# EasyEDA Pro project ProPrj_PiezoBuds-final_2024-09-30.epro

# Schematic Schematic1
Create Date: 2024-03-19; Page Name: P1; Project Name: PiezoBuds-final; Schematic Name: Schematic1; Update Date: 2024-03-19; Company: 嘉立创EDA; Page Size: A4; Version: V1.0
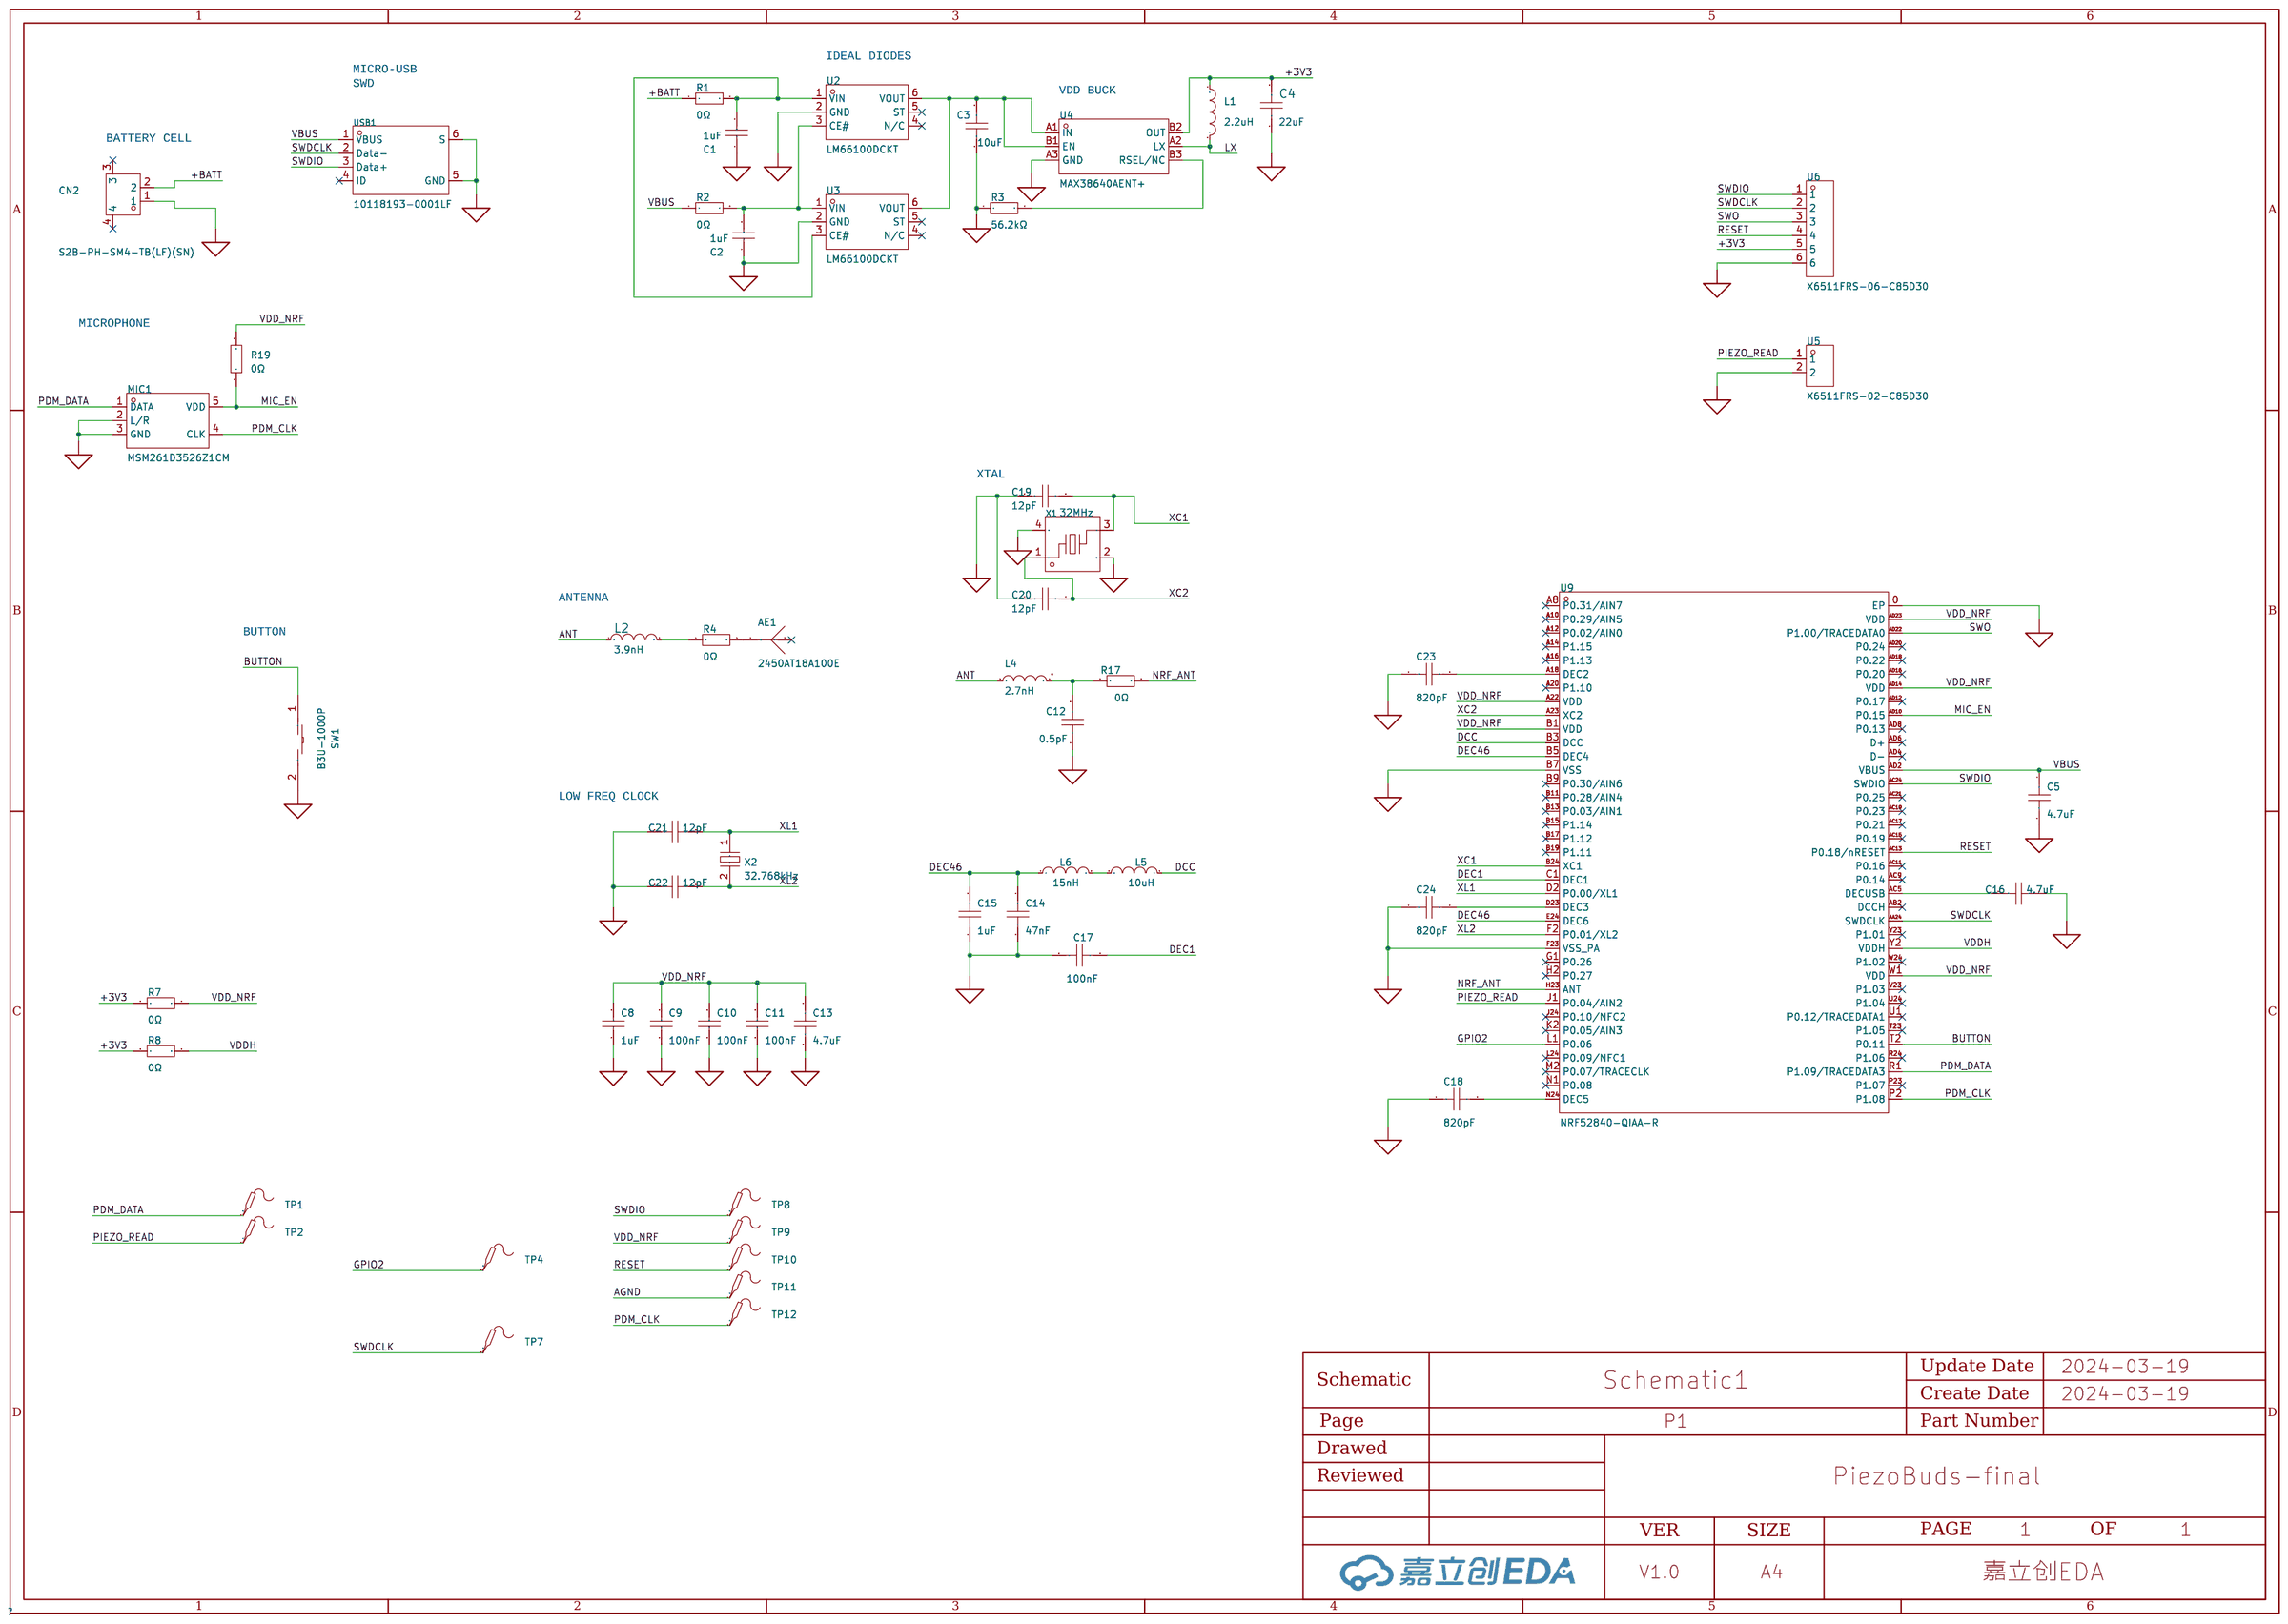
[diagram p0: schematic sheet]

## Parts
AE1  2450AT18A100E  [ANT-SMD_L3.2-W1.6]
C1  1uF  [C0402]
C2  1uF  [C0402]
C3  10uF  [C0402]
C4  22uF  [C0402]
C5  4.7uF  [C0402]
C8  1uF  [C0402]
C9  100nF  [C0201]
C10  100nF  [C0201]
C11  100nF  [C0201]
C12  0.5pF  [C0201]
C13  4.7uF  [C0402]
C14  47nF  [C0201]
C15  1uF  [C0402]
C16  4.7uF  [C0402]
C17  100nF  [C0201]
C18  820pF  [C0201]
C19  12pF  [C0201]
C20  12pF  [C0201]
C21  12pF  [C0201]
C22  12pF  [C0201]
C23  820pF  [C0201]
C24  820pF  [C0201]
CN2  S2B-PH-SM4-TB(LF)(SN)  [CONN-SMD_P2.00_S2B-PH-SM4-TB-LF-SN]
L1  2.2uH  [L0603]
L2  3.9nH  [IND-SMD_L1.0-W0.5-2]
L4  2.7nH  [L0201-RD]
L5  10uH  [L0603]
L6  15nH  [L0201]
MIC1  MSM261D3526Z1CM  [OCLGA-6_L3.5-W2.7-TL-MSM261D3526Z1CM]
R1  0Ω  [R0201]
R2  0Ω  [R0201]
R3  56.2kΩ  [R0201]
R4  0Ω  [R0201]
R7  0Ω  [R0402]
R8  0Ω  [R0402]
R17  0Ω  [R0201]
R19  0Ω  [R0201]
SW1  B3U-1000P  [KEY-SMD_B3U-1000PM]
TP1  -  [Test-Point-0.5mm]
TP2  -  [Test-Point-0.5mm]
TP4  -  [Test-Point-0.5mm]
TP7  -  [Test-Point-0.5mm]
TP8  -  [Test-Point-0.5mm]
TP9  -  [Test-Point-0.5mm]
TP10  -  [Test-Point-0.5mm]
TP11  -  [Test-Point-0.5mm]
TP12  -  [Test-Point-0.5mm]
U2  LM66100DCKT  [SC-70-6_L2.0-W1.3-P0.65-LS2.1-BL]
U3  LM66100DCKT  [SC-70-6_L2.0-W1.3-P0.65-LS2.1-BL]
U4  MAX38640AENT+  [WLP-6_L1.4-W0.9-R2-C3-P0.40-TL]
U5  X6511FRS-02-C85D30  [HDR-SMD_2P-P2.54-H-F-L11.5]
U6  X6511FRS-06-C85D30  [HDR-SMD_6P-P2.54-H-F-L11.5]
U9  NRF52840-QIAA-R  [AQFN-73_L7.0-W7.0-P0.50-BL-EP4.8]
USB1  10118193-0001LF  [MICRO-USB-SMD_10118193-0001LF]
X1  32MHz  [CRYSTAL-SMD_4P-L2.0-W1.6-BL]
X2  32.768kHz  [CRYSTAL-SMD_L3.2-W1.5-1]

## Library data of the parts
AE1 = 2450AT18A100E: 天线类型:迷你2.45 GHz天线;中心频点:2.4GHz;带宽:-;峰值增益:0.5dBi;驻波比:-;极化方式:-;阻抗:50Ω;功率容量:2W;; Supplier Part: C89334; Manufacturer: JOHANSON(约翰逊); Supplier Footprint: 3.2mmLx1.6mmWx1.3mmH; JLCPCB Part Class: 扩展库; Datasheet: https://atta.szlcsc.com/upload/public/pdf/source/20180301/C89334_15198946260391384223.pdf; Supplier: LCSC; Antenna Type: 迷你2.45 GHz天线; Central Frequency: 2.4GHz; Peak Gain: 0.5dBi; Impedance: 50Ω; Power capacity: 2W; Operating Temperature: -40℃~+125℃
C1 C2 C8 = CL05A105KQ5NNNC: 容值:1uF;精度:±10%;额定电压:6.3V;材质(温度系数):X5R;; LCSC Part Name: 1uF ±10% 6.3V; Supplier Part: C107372; Manufacturer: SAMSUNG(三星); Supplier Footprint: 0402; JLCPCB Part Class: 扩展库; Datasheet: https://atta.szlcsc.com/upload/public/pdf/source/20170413/1492062766541.pdf; Supplier: LCSC; Tolerance: ±10%; Voltage Rated: 6.3V; Temperature Coefficient: X5R
C3 = CL05A106MP5NUNC: 容值:10uF;精度:±20%;额定电压:10V;材质(温度系数):X5R;; LCSC Part Name: 10uF ±20% 10V; Supplier Part: C315248; Manufacturer: SAMSUNG(三星); Supplier Footprint: 0402; JLCPCB Part Class: 扩展库; Datasheet: https://atta.szlcsc.com/upload/public/pdf/source/20200102/C478861_C4302703595930F3C0E62DAD3349F1AA.pdf; Supplier: LCSC; Tolerance: ±20%; Voltage Rated: 10V; Temperature Coefficient: X5R
C4 = GRM155R60J226ME11D: 容值:22uF;精度:±20%;额定电压:6.3V;材质(温度系数):X5R;; LCSC Part Name: 22uF ±20% 6.3V; Supplier Part: C415703; Manufacturer: muRata(村田); Supplier Footprint: 0402; JLCPCB Part Class: 扩展库; Datasheet: https://atta.szlcsc.com/upload/public/pdf/source/20200305/C490387_23319AE8C154DEB24C505E6C82A8106A.pdf; Supplier: LCSC; Tolerance: ±20%; Voltage Rated: 6.3V; Temperature Coefficient: X5R
C5 = C1005X6S0G475M050BC: 容值:4.7uF;精度:±20%;额定电压:4V;材质(温度系数):X6S;; LCSC Part Name: 4.7uF ±20% 4V; Supplier Part: C2168059; Manufacturer: TDK; Supplier Footprint: 0402; JLCPCB Part Class: 扩展库; Datasheet: https://atta.szlcsc.com/upload/public/pdf/source/20210430/12912E3792F621391F28022904E5A4A4.pdf; Supplier: LCSC; Tolerance: ±20%; Voltage Rated: 4V; Temperature Coefficient: X6S
C9-C11 = GRM033C71C104KE14D: 容值:100nF;精度:±10%;额定电压:16V;材质(温度系数):X7S;; LCSC Part Name: 100nF ±10% 16V; Supplier Part: C85923; Manufacturer: muRata(村田); Supplier Footprint: 0201; JLCPCB Part Class: 扩展库; Datasheet: https://atta.szlcsc.com/upload/public/pdf/source/20180326/C85923_B6CADFAB9310CDDF0A43189D0F44CCF4.pdf; Supplier: LCSC; Tolerance: ±10%; Voltage Rated: 16V; Temperature Coefficient: X7S
C12 = 0201CG0R5B250NT: 容值:0.5pF;额定电压:25V;材质(温度系数):C0G;; LCSC Part Name: 0.5pF 25V ±0.1pF; Supplier Part: C285115; Manufacturer: FH(风华); Supplier Footprint: 0201; JLCPCB Part Class: Extended Part; Datasheet: https://atta.szlcsc.com/upload/public/pdf/source/20180917/C285115_430A46DCDD77E98C3CB63F008439EE94.pdf; Supplier: LCSC; Voltage Rated: 25V; Temperature Coefficient: C0G
C13 C16 = CL05A475KP5NRNC: 容值:4.7uF;精度:±10%;额定电压:10V;材质(温度系数):X5R;; LCSC Part Name: 4.7uF ±10% 10V; Supplier Part: C368809; Manufacturer: SAMSUNG(三星); Supplier Footprint: 0402; JLCPCB Part Class: Extended Part; Datasheet: https://atta.szlcsc.com/upload/public/pdf/source/20190214/C368809_F5BC89A17870A6A4D09EEE17ED063906.pdf; Supplier: LCSC; Tolerance: ±10%; Voltage Rated: 10V; Temperature Coefficient: X5R
C14 = CL03A473KQ3NNNC: 容值:47nF;精度:±10%;额定电压:6.3V;材质(温度系数):X5R;; LCSC Part Name: 47nF ±10% 6.3V; Supplier Part: C318551; Manufacturer: SAMSUNG(三星); Supplier Footprint: 0201; JLCPCB Part Class: Extended Part; Datasheet: https://atta.szlcsc.com/upload/public/pdf/source/20181113/C318551_E4E5F1A22752090EA3F567BE743DB571.pdf; Supplier: LCSC; Tolerance: ±10%; Voltage Rated: 6.3V; Temperature Coefficient: X5R
C15 = GRM155R70J105KA12D: 容值:1uF;精度:±10%;额定电压:6.3V;材质(温度系数):X7R;; LCSC Part Name: 1uF ±10% 6.3V; Supplier Part: C88945; Manufacturer: muRata(村田); Supplier Footprint: 0402; JLCPCB Part Class: 扩展库; Datasheet: https://atta.szlcsc.com/upload/public/pdf/source/20161125/1480068029517.pdf; Supplier: LCSC; Tolerance: ±10%; Voltage Rated: 6.3V; Temperature Coefficient: X7R
C17 = CL03A104KQ3NNNC: 容值:100nF;精度:±10%;额定电压:6.3V;材质(温度系数):X5R;; LCSC Part Name: 100nF ±10% 6.3V; Supplier Part: C160831; Manufacturer: SAMSUNG(三星); Supplier Footprint: 0201; JLCPCB Part Class: 扩展库; Datasheet: https://atta.szlcsc.com/upload/public/pdf/source/20171228/C160831_15144412250661213800.pdf; Supplier: LCSC; Tolerance: ±10%; Voltage Rated: 6.3V; Temperature Coefficient: X5R
C18 C23 C24 = GRM0335C1E821JA01D: 容值:820pF;精度:±5%;额定电压:25V;材质(温度系数):C0G;; LCSC Part Name: 820pF ±5% 25V; Supplier Part: C384953; Manufacturer: muRata(村田); Supplier Footprint: 0201; JLCPCB Part Class: 扩展库; Datasheet: https://atta.szlcsc.com/upload/public/pdf/source/20190819/C384953_90F8D2DF1F187266CD17B94714A2AC04.pdf; Supplier: LCSC; Tolerance: ±5%; Voltage Rated: 25V; Temperature Coefficient: C0G
C19-C22 = GRM0335C1E120GA01D: 容值:12pF;精度:±2%;额定电压:25V;材质(温度系数):C0G;; LCSC Part Name: 12pF ±2% 25V; Supplier Part: C426109; Manufacturer: muRata(村田); Supplier Footprint: 0201; JLCPCB Part Class: Extended Part; Datasheet: https://atta.szlcsc.com/upload/public/pdf/source/20190904/C426109_89A0F94841657D9DD7212A5F70B4EFC9.pdf; Supplier: LCSC; Tolerance: ±2%; Voltage Rated: 25V; Temperature Coefficient: C0G
CN2 = S2B-PH-SM4-TB(LF)(SN): 插针结构:1x2P;间距:2mm;安装方式:卧贴;参考系列:PH;总PIN数:2P;排数:1;每排PIN数:2;行距:-;额定电流:2A;触头材质:铜合金;触头镀层:锡;工作温度范围:-25℃~+85℃;; Supplier Part: C295747; Manufacturer: JST; Supplier Footprint: SMD,P=2mm,卧贴; JLCPCB Part Class: 扩展库; Datasheet: https://atta.szlcsc.com/upload/public/pdf/source/20210203/C295747_344B2E64535E381E727D98C302AB61C7.pdf; Supplier: LCSC; Pins Structure: 1x2P; Pitch: 2mm; Mounting Style: 卧贴; Reference Series: PH; Number of Pins: 2P; Number of Rows: 1; Number of PINs Per Row: 2; Current Rating (Max): 2A; Contact Material: 铜合金; Contact Plating: 锡; Operating Temperature Range: -25℃~+85℃
L1 = SLM16082R2MIT: 类型:-;电感值:2.2uH;精度:±20%;额定电流:250mA;饱和电流(Isat):-;; LCSC Part Name: 2.2uH ±20% 250mA 520mΩ; Supplier Part: C206337; Manufacturer: Sunltech(韩国顺磁); Supplier Footprint: 0603; JLCPCB Part Class: 扩展库; Datasheet: https://atta.szlcsc.com/upload/public/pdf/source/20180403/C206337_E548C6A727BE278C464F4936109BA35D.pdf; Supplier: LCSC; Tolerance: ±20%; Rated Current: 250mA; DC Resistance (DCR): 520mΩ
L2 = LQW15AN3N9C00D: 电感值:3.9nH;额定电流:-;饱和电流(Isat):-;直流电阻(DCR):70mΩ;; Supplier Part: C98063; Manufacturer: muRata(村田); Supplier Footprint: 0402; JLCPCB Part Class: 扩展库; Datasheet: https://atta.szlcsc.com/upload/public/pdf/source/20191016/C437364_463D6516B3BAE72B1DA0754F3D9B8308.pdf; Supplier: LCSC; DC Resistance (DCR): 70mΩ; Q @ Freq: 25@250MHz; Frequency - Self Resonant: 10GHz
L4 = LQP03TG2N7B02D: 电感值:2.7nH;精度:-;额定电流:450mA;饱和电流(Isat):-;直流电阻(DCR):250mΩ;; LCSC Part Name: 2.7nH ±0.1nH; Supplier Part: C86109; Manufacturer: muRata(村田); Supplier Footprint: 0201; JLCPCB Part Class: 扩展库; Datasheet: https://atta.szlcsc.com/upload/public/pdf/source/20180327/C86109_85E67C6134C24C7F74EB92E54F80A506.pdf; Supplier: LCSC; Rated Current: 450mA; DC Resistance (DCR): 250mΩ; Q @ Freq: 13@500MHz; Frequency - Self Resonant: 13.1GHz
L5 = MLZ1608N100LT000: 电感值:10uH;精度:±20%;额定电流:300mA;饱和电流(Isat):60mA;直流电阻(DCR):600mΩ;; LCSC Part Name: 10uH ±20% 60mA; Supplier Part: C194437; Manufacturer: TDK; Supplier Footprint: 0603; JLCPCB Part Class: 扩展库; Datasheet: https://atta.szlcsc.com/upload/public/pdf/source/20190107/C194437_EB92F128B114A0F5510FACF64F923EBD.pdf; Supplier: LCSC; Tolerance: ±20%; Rated Current: 300mA; Saturation Current (Isat): 60mA; DC Resistance (DCR): 600mΩ
L6 = LQP03TN15NJ02D: 直流电阻(DCR):700mΩ;精度:±5%;电感值:15nH;额定电流:3.8A;饱和电流(Isat):-;; LCSC Part Name: 15nH ±5%; Supplier Part: C206455; Manufacturer: muRata(村田); Supplier Footprint: 0201; JLCPCB Part Class: Extended Part; Datasheet: https://atta.szlcsc.com/upload/public/pdf/source/20180612/C206455_9F5A8FF86B12D39600F2157860CD3357.pdf; Supplier: LCSC; DC Resistance (DCR): 700mΩ; Tolerance: ±5%; Rated Current: 3.8A; Q @ Freq: 12 500MHz; Frequency - Self Resonant: 2.6GHz
MIC1 = MSM261D3526Z1CM: 方向:全指向;灵敏度:-26dB；-25dB;信噪比:62dB；64dB;电流消耗:670uA；290uA;电源电压:1.8V;阻抗:-;; Supplier Part: C966937; Manufacturer: MEMS(敏芯微); Supplier Footprint: LGA-5(2.7x3.5); Datasheet: https://atta.szlcsc.com/upload/public/pdf/source/20210104/C966937_DDD8123A44DF487854FEE980E1D7EA5A.pdf; Supplier: LCSC; Direction: 全指向; Sensitivity: -26dB；-25dB; SNR(Signal to Noise Ratio): 62dB；64dB; Current Consumption: 670uA；290uA; Supply Voltage: 1.8V
R1 R2 R4 R17 R19 = RC0201JR-070RL: 温度系数:-;工作温度范围:-55℃~+155℃;电阻长:-;精度:±5%;电阻直径:-;电阻高:-;电阻宽:-;最大工作电压:25V;电阻类型:厚膜电阻;阻值:0Ω;功率:50mW;; LCSC Part Name: 0Ω ±5%; Supplier Part: C106228; Manufacturer: YAGEO(国巨); Supplier Footprint: 0201; JLCPCB Part Class: 扩展库; Datasheet: https://atta.szlcsc.com/upload/public/pdf/source/20170912/C106228_1505207468789963235.pdf; Supplier: LCSC; Operating Temperature Range: -55℃~+155℃; Tolerance: ±5%; Overload Voltage (Max): 25V; Type: 厚膜电阻; Power(Watts): 50mW
R3 = RC0201FR-0756K2L: 电阻类型:厚膜电阻;阻值:56.2kΩ;精度:±1%;功率:50mW;最大工作电压:25V;温度系数:±200ppm/℃;; LCSC Part Name: 厚膜电阻 56.2kΩ ±1% 50mW; Supplier Part: C327383; Manufacturer: YAGEO(国巨); Supplier Footprint: 0201; JLCPCB Part Class: Extended Part; Datasheet: https://atta.szlcsc.com/upload/public/pdf/source/20181031/C327383_E4A175C782E789857E6379955203C984.pdf; Supplier: LCSC; Type: 厚膜电阻; Tolerance: ±1%; Power(Watts): 50mW; Overload Voltage (Max): 25V; Temperature Coefficient: ±200ppm/℃; Operating Temperature Range: -55℃~+125℃
R7 R8 = RC0402FR-070RL: 电阻类型:厚膜电阻;阻值:0Ω;精度:-;功率:62.5mW;; LCSC Part Name: 0Ω 62.5mW; Supplier Part: C106231; Manufacturer: YAGEO(国巨); Supplier Footprint: 0402; JLCPCB Part Class: 扩展库; Datasheet: https://atta.szlcsc.com/upload/public/pdf/source/20170518/1495085712260.pdf; Supplier: LCSC; Type: 厚膜电阻; Power(Watts): 62.5mW; Overload Voltage (Max): 50V; Operating Temperature Range: -55℃~+155℃
SW1 = B3U-1000P: 触点电流:50mA;额定电压(DC):12V;电路结构:单刀单掷;安装方式:立贴;带灯:-;机械寿命:-;; LCSC Part Name: 3*2.5*1.6mm 立贴 轻触开关; Supplier Part: C231329; Manufacturer: OMRON(欧姆龙); Supplier Footprint: SMD,2.5x3mm; JLCPCB Part Class: 扩展库; Datasheet: https://atta.szlcsc.com/upload/public/pdf/source/20180629/C231329_070179C33643744C5978F4F02109B85D.pdf; Supplier: LCSC; Contact Current: 50mA; Voltage Rating (DC): 12V; Circuit: 单刀单掷; Mounting Style: 立贴; Actuator Style: 圆形按钮; Switch Length: 3mm; Switch Width: 2.5mm; Switch Height: 1.6mm
TP1 TP2 TP4 TP7-TP12 = Test-Point: Test Point 测试点
U2 U3 = LM66100DCKT_C2832141: Supplier Part: C2832141; Manufacturer: TI(德州仪器); Supplier Footprint: SC-70-6; JLCPCB Part Class: 扩展库; Datasheet: 2021-05-06/732163A/921a6e0c70be483eae5728de2d2d7fc9/lm66100.pdf; Supplier: LCSC
U4 = MAX38640AENT+: Supplier Part: C5328753; Manufacturer: ADI(亚德诺); Supplier Footprint: WLP-6; JLCPCB Part Class: Extended Part; Datasheet: https://atta.szlcsc.com/upload/public/pdf/source/20210226/C1544069_75AFA4CA0D4CEB88C64289422689D1E7.pdf; Supplier: LCSC
U5 = X6511FRS-02-C85D30: 插孔结构:1x2P;间距:2.54mm;安装类型:卧贴;排数:单排;总孔位数:2P;塑高:8.5mm;; LCSC Part Name: 间距:2.54mm 1x2P 卧贴; Supplier Part: C5142235; Manufacturer: XKB Connectivity(中国星坤); Supplier Footprint: SMD,P=2.54mm,卧贴; JLCPCB Part Class: 扩展库; Datasheet: https://atta.szlcsc.com/upload/public/pdf/source/20220822/AB9A82E80C220285963E5EFA3BFD32FF.pdf; Supplier: LCSC; Holes Structure: 1x2P; Pitch: 2.54mm; Mounting Type: 卧贴; Number of Rows: 单排; Number of Holes: 2P; Insulation Height: 8.5mm
U6 = X6511FRS-06-C85D30: 插孔结构:1x6P;间距:2.54mm;安装类型:卧贴;排数:单排;总孔位数:6P;塑高:8.5mm;; LCSC Part Name: 间距:2.54mm 1x6P 卧贴; Supplier Part: C5142239; Manufacturer: XKB Connectivity(中国星坤); Supplier Footprint: SMD,P=2.54mm,卧贴; JLCPCB Part Class: 扩展库; Datasheet: https://atta.szlcsc.com/upload/public/pdf/source/20220822/AB9A82E80C220285963E5EFA3BFD32FF.pdf; Supplier: LCSC; Holes Structure: 1x6P; Pitch: 2.54mm; Mounting Type: 卧贴; Number of Rows: 单排; Number of Holes: 6P; Insulation Height: 8.5mm
U9 = NRF52840-QIAA-R: LCSC Part Name: 蓝牙，IEEE 802.15.4-2006，2.4GHz收发器; Supplier Part: C190794; Manufacturer: NORDIC; Supplier Footprint: AQFN-73-EP(7x7); JLCPCB Part Class: 扩展库; Datasheet: https://atta.szlcsc.com/upload/public/pdf/source/20200927/C190794_1756B5489BD6AA72AA26FA1BF8B48337.pdf; Supplier: LCSC
USB1 = 10118193-0001LF: Supplier Part: C132562; Manufacturer: Amphenol; Supplier Footprint: SMD; JLCPCB Part Class: 扩展库; Supplier: LCSC
X1 = Q22FA1280002500: 晶振类型:贴片晶振;频率:32MHz;常温频差:±10ppm;外接负载电容:8pF;; LCSC Part Name: 32MHz ±10ppm 8pF; Supplier Part: C187794; Manufacturer: EPSON(爱普生); Manufacturer Part: Q22FA12800025; Supplier Footprint: SMD2016-4P; JLCPCB Part Class: Extended Part; Datasheet: https://atta.szlcsc.com/upload/public/pdf/source/20180822/C255901_8E0AFBA406FEDAEAC9B2913D0F1BB689.pdf; Supplier: LCSC; Crystal Type: 贴片晶振; Frequency Tolerance: ±10ppm; Load Capacitance: 8pF; Equivalent Series Resistance (ESR): 60Ω; Operating Temperature: -40℃~+85℃; Normal temperature Frequency Tolerance: ±10ppm; External load capacitor: 8pF
X2 = NX3215SA-32.768K-STD-MUA-9: 晶振类型:-;频率:32.768kHz;常温频差:±20ppm;外接负载电容:9pF;; LCSC Part Name: 32.768kHz ±20ppm 9pF; Supplier Part: C519280; Manufacturer: NDK; Supplier Footprint: SMD3215-2P; JLCPCB Part Class: Extended Part; Datasheet: https://atta.szlcsc.com/upload/public/pdf/source/20200427/C519280_14BACA32631F1F3A49A8251846C55372.pdf; Supplier: LCSC; Operating Temperature: -40℃~+85℃; Normal temperature Frequency Tolerance: ±20ppm; External load capacitor: 9pF; Equivalent Series Resistance (ESR): 70kΩ

## Nets
+3V3: C4.2 L1.1 R7.1 R8.1 U4.B2(OUT) U6.5
AGND: C1.1 C2.1 C3.1 C4.1 C5.2 C8.1 C9.2 C10.2 C11.2 C12.1 C13.1 C14.2 C15.1 C16.1 C17.2 C18.1 C19.1 C20.1 C21.1 C22.1 C23.1 C24.1 CN2.1 MIC1.2(L/R) MIC1.3(GND) R3.1 SW1.2 TP11.1 U2.2(GND) U3.2(GND) U4.A3(GND) U5.2 U6.6 U9.0(EP) U9.B7(VSS) U9.F23(VSS_PA) USB1.5(GND) USB1.6(S) X1.2(GND) X1.4(GND)
VBUS: C5.1 R2.1 U9.AD2(VBUS) USB1.1(VBUS)
VDD_NRF: C8.2 C9.1 C10.1 C11.1 C13.2 R7.2 R19.2 TP9.1 U9.A22(VDD) U9.AD14(VDD) U9.AD23(VDD) U9.B1(VDD) U9.W1(VDD)
VDDH: R8.2 U9.Y2(VDDH)
+BATT: CN2.2 R1.1
ANT: L2.1 L4.2
BUTTON: SW1.1 U9.T2(P0.11)
DCC: L5.2 U9.B3(DCC)
DEC1: C17.1 U9.C1(DEC1)
DEC46: C14.1 C15.2 L6.1 U9.B5(DEC4) U9.E24(DEC6)
GPIO2: TP4.1 U9.L1(P0.06)
LX: L1.2 U4.A2(LX)
MIC_EN: MIC1.5(VDD) R19.1 U9.AD10(P0.15)
NRF_ANT: R17.2 U9.H23(ANT)
PDM_CLK: MIC1.4(CLK) TP12.1 U9.P2(P1.08)
PDM_DATA: MIC1.1(DATA) TP1.1 U9.R1(P1.09/TRACEDATA3)
PIEZO_READ: TP2.1 U5.1 U9.J1(P0.04/AIN2)
RESET: TP10.1 U6.4 U9.AC13(P0.18/nRESET)
SWDCLK: TP7.1 U6.2 U9.AA24(SWDCLK) USB1.2(Data-)
SWDIO: TP8.1 U6.1 U9.AC24(SWDIO) USB1.3(Data+)
SWO: U6.3 U9.AD22(P1.00/TRACEDATA0)
XC1: C19.2 U9.B24(XC1) X1.3
XC2: C20.2 U9.A23(XC2) X1.1
XL1: C21.2 U9.D2(P0.00/XL1) X2.1
XL2: C22.2 U9.F2(P0.01/XL2) X2.2
$1N2608: C2.2 R2.2 U2.3(CE#) U3.1(VIN)
$1N2669: C3.2 U2.6(VOUT) U3.6(VOUT) U4.A1(IN) U4.B1(EN)
$1N2785: R3.2 U4.B3(RSEL/NC)
$1N3382: AE1.1(ANT) R4.2
$1N5000: L2.2 R4.1
$1N15802: C1.2 R1.2 U2.1(VIN) U3.3(CE#)
$1N38769: C16.2 U9.AC5(DECUSB)
$1N38954: C18.2 U9.N24(DEC5)
$1N39111: C12.2 L4.1 R17.1
$1N39307: L5.1 L6.2
$1N39479: C23.2 U9.A18(DEC2)
$1N39540: C24.2 U9.D23(DEC3)

Not connected (* = marked no-connect by the designer): AE1 2*; CN2 3* 4*; U2 4(N/C)* 5(ST)*; U3 4(N/C)* 5(ST)*; U9 A8(P0.31/AIN7)* A10(P0.29/AIN5)* A12(P0.02/AIN0)* A14(P1.15)* A16(P1.13)* A20(P1.10)* AB2(DCCH)* AC9(P0.14)* AC11(P0.16)* AC15(P0.19)* AC17(P0.21)* AC19(P0.23)* AC21(P0.25)* AD4(D-)* AD6(D+)* AD8(P0.13)* AD12(P0.17)* AD16(P0.20)* AD18(P0.22)* AD20(P0.24)* B9(P0.30/AIN6)* B11(P0.28/AIN4)* B13(P0.03/AIN1)* B15(P1.14)* B17(P1.12)* B19(P1.11)* G1(P0.26)* H2(P0.27)* J24(P0.10/NFC2)* K2(P0.05/AIN3)* L24(P0.09/NFC1)* M2(P0.07/TRACECLK)* N1(P0.08)* P23(P1.07)* R24(P1.06)* T23(P1.05)* U1(P0.12/TRACEDATA1)* U24(P1.04)* V23(P1.03)* W24(P1.02)* Y23(P1.01)*; USB1 4(ID)*

## Notes on the sheet
- IDEAL DIODES
- MICRO-USB
  SWD
- VDD BUCK
- BATTERY CELL
- MICROPHONE
- XTAL
- ANTENNA
- BUTTON
- LOW FREQ CLOCK

# Board PCB5
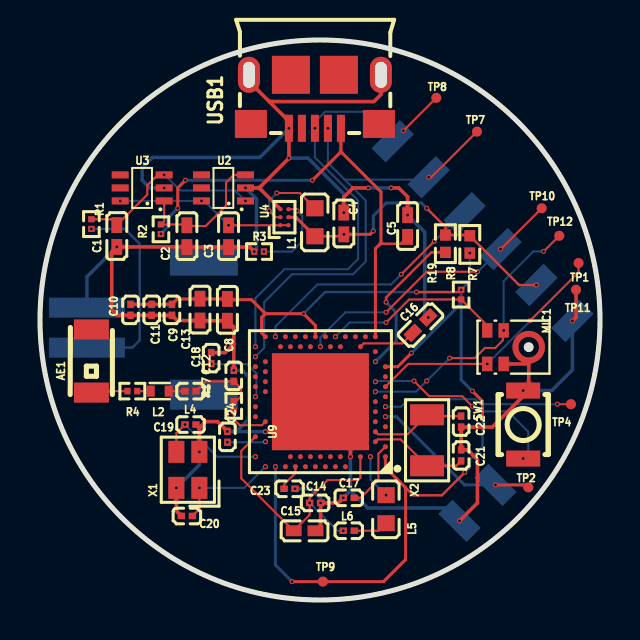
[diagram p1: board, top side]
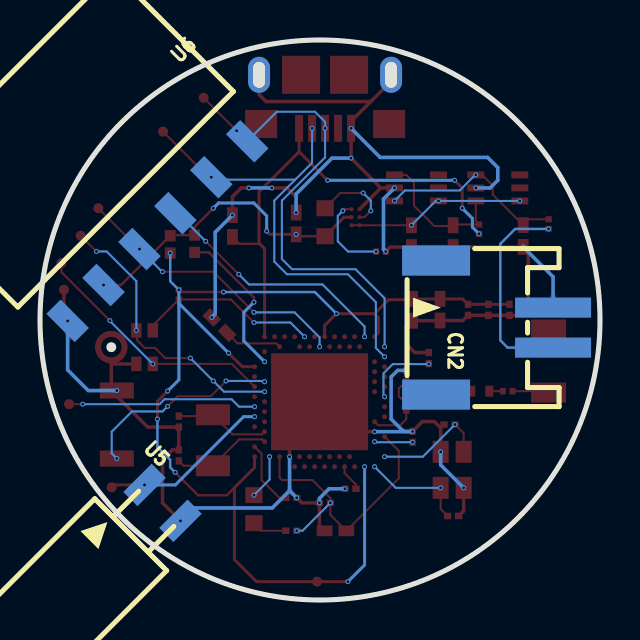
[diagram p2: board, bottom side, seen from below]

Outline 28 x 28 mm; copper layers: Top Layer, Bottom Layer. Coordinates in mm from the lower left corner of the outline.
Outline path: circle c14,14 r14
Stack: Top Layer 0.035mm / Dielectric1 1.51mm FR4 er 4.5 / Bottom Layer 0.035mm

## Design rules (mm)
template: 自定义配置
spacing copperThickness1oz (default): track to track 0.102, other pairs 0.102 to 0.3
spacing copperThickness2oz: track to track 0.203, other pairs 0.152 to 0.3
track width copperLine (default): min 0.102, default 0.102, max 0.102
track width Source: min 0.119, default 0.119, max 0.15
track width Ground: min 0.175, default 0.175, max 0.175
differential pair differentialPair (default): width min 0.127, default 0.254, max 2.54; gap min 0.152, default 0.152
via viaSize (default): diameter min 0.249, default 0.249, max 0.249; hole min 0.15, default 0.15, max 0.15
net AGND uses Ground
net VDD_NRF uses Source
net VBUS uses Source
net VDDH uses Source
net +BATT uses Source
net PIEZO_READ uses Source
net +3V3 uses Source

## Placement (name value [footprint] x y rotation side)
AE1  2450AT18A100E  [ANT-SMD_L3.2-W1.6]  2.57 11.95 90 top
C1  1uF  [C0402]  3.84 18.2 90 top
C2  1uF  [C0402]  7.34 18.19 90 top
C3  10uF  [C0402]  9.43 18.19 90 top
C4  22uF  [C0402]  15.19 18.83 270 top
C5  4.7uF  [C0402]  18.38 18.7 90 top
C8  1uF  [C0402]  9.37 14.51 90 top
C9  100nF  [C0201]  6.6 14.51 270 top
C10  100nF  [C0201]  4.53 14.51 270 top
C11  100nF  [C0201]  5.58 14.51 270 top
C12  0.5pF  [C0201]  9.69 11.21 270 top
C13  4.7uF  [C0402]  8 14.52 90 top
C14  47nF  [C0201]  13.76 4.86 0 top
C15  1uF  [C0402]  13.23 3.46 180 top
C16  4.7uF  [C0402]  19.03 13.74 225 top
C17  100nF  [C0201]  15.44 5.11 180 top
C18  820pF  [C0201]  8.56 12.09 270 top
C19  12pF  [C0201]  7.52 8.77 180 top
C20  12pF  [C0201]  7.34 4.2 0 top
C21  12pF  [C0201]  21.06 7.23 270 top
C22  12pF  [C0201]  21.06 8.92 90 top
C23  820pF  [C0201]  12.48 5.56 180 top
C24  820pF  [C0201]  9.37 8.16 270 top
CN2  S2B-PH-SM4-TB(LF)(SN)  [CONN-SMD_P2.00_S2B-PH-SM4-TB-LF-SN]  5.27 13.62 270 bottom
L1  2.2uH  [L0603]  13.75 18.89 90 top
L2  3.9nH  [IND-SMD_L1.0-W0.5-2]  5.99 10.44 180 top
L4  2.7nH  [L0201-RD]  7.52 10.44 180 top
L5  10uH  [L0603]  17.3 4.54 90 top
L6  15nH  [L0201]  15.44 3.46 0 top
MIC1  MSM261D3526Z1CM  [OCLGA-6_L3.5-W2.7-TL-MSM261D3526Z1CM]  23.4 12.64 90 top
R1  0Ω  [R0201]  2.57 18.8 90 top
R2  0Ω  [R0201]  6.05 18.54 90 top
R3  56.2kΩ  [R0201]  10.95 17.42 0 top
R4  0Ω  [R0201]  4.62 10.44 180 top
R7  0Ω  [R0402]  21.49 17.78 270 top
R8  0Ω  [R0402]  20.27 17.81 270 top
R17  0Ω  [R0201]  9.69 9.71 270 top
R19  0Ω  [R0201]  21.06 15.27 90 top
SW1  B3U-1000P  [KEY-SMD_B3U-1000PM]  24.16 8.77 90 top
TP1  -  [Test-Point-0.5mm]  26.93 16.85 0 top
TP2  -  [Test-Point-0.5mm]  24.41 5.63 0 top
TP4  -  [Test-Point-0.5mm]  26.55 9.79 0 top
TP7  -  [Test-Point-0.5mm]  21.85 23.42 0 top
TP8  -  [Test-Point-0.5mm]  19.82 25.11 0 top
TP9  -  [Test-Point-0.5mm]  14.15 0.92 0 top
TP10  -  [Test-Point-0.5mm]  25.08 19.59 0 top
TP11  -  [Test-Point-0.5mm]  26.8 15.51 0 top
TP12  -  [Test-Point-0.5mm]  25.97 18.21 0 top
U2  LM66100DCKT  [SC-70-6_L2.0-W1.3-P0.65-LS2.1-BL]  9.17 20.6 90 top
U3  LM66100DCKT  [SC-70-6_L2.0-W1.3-P0.65-LS2.1-BL]  5.11 20.6 90 top
U4  MAX38640AENT+  [WLP-6_L1.4-W0.9-R2-C3-P0.40-TL]  12.22 19.14 90 top
U5  X6511FRS-02-C85D30  [HDR-SMD_2P-P2.54-H-F-L11.5]  21.87 4.86 225 bottom
U6  X6511FRS-06-C85D30  [HDR-SMD_6P-P2.54-H-F-L11.5]  22.13 18.44 315 bottom
U9  NRF52840-QIAA-R  [AQFN-73_L7.0-W7.0-P0.50-BL-EP4.8]  14.02 9.92 90 top
USB1  10118193-0001LF  [MICRO-USB-SMD_10118193-0001LF]  13.75 24.92 180 top
X1  32MHz  [CRYSTAL-SMD_4P-L2.0-W1.6-BL]  7.39 6.51 90 top
X2  32.768kHz  [CRYSTAL-SMD_L3.2-W1.5-1]  19.35 7.99 90 top

## Footprints (pads in the part's own frame, mm; a bottom-side part is the same pattern mirrored in y, then rotated)
ANT-SMD_L3.2-W1.6
  rect 1x1.75 smd: 1(-1.578,0) 2(1.578,0)
AQFN-73_L7.0-W7.0-P0.50-BL-EP4.8
  rect 4.85x4.85 smd: 0(0,0)
  round 0.25 smd: A8(-3.25,-1.25) A10(-3.25,-0.75) A12(-3.25,-0.25) A14(-3.25,0.25) A16(-3.25,0.75) A18(-3.25,1.25) A20(-3.25,1.75) A22(-3.25,2.25) A23(-3.25,2.75) AA24(2.25,3.25) AB2(2.5,-2.75) AC5(2.75,-2) AC9(2.75,-1) AC11(2.75,-0.5) AC13(2.75,0) AC15(2.75,0.5) AC17(2.75,1) AC19(2.75,1.5) AC21(2.75,2) AC24(2.75,3.25) AD2(3.25,-2.75) AD4(3.25,-2.25) AD6(3.25,-1.75) AD8(3.25,-1.25) AD10(3.25,-0.75) AD12(3.25,-0.25) AD14(3.25,0.25) AD16(3.25,0.75) AD18(3.25,1.25) AD20(3.25,1.75) AD22(3.25,2.25) AD23(3.25,2.75) B1(-2.75,-3.25) B3(-2.75,-2.5) B5(-2.75,-2) B7(-2.75,-1.5) B9(-2.75,-1) B11(-2.75,-0.5) B13(-2.75,0) B15(-2.75,0.5) B17(-2.75,1) B19(-2.75,1.5) B24(-2.75,3.25) C1(-2.25,-3.25) D2(-2,-2.75) D23(-2,2.75) E24(-1.75,3.25) F2(-1.5,-2.75) F23(-1.5,2.75) G1(-1.25,-3.25) H2(-1,-2.75) H23(-1,2.75) J1(-0.75,-3.25) J24(-0.75,3.25) K2(-0.5,-2.75) L1(-0.25,-3.25) L24(-0.25,3.25) M2(0,-2.75) N1(0.25,-3.25) N24(0.25,3.25) P2(0.5,-2.75) P23(0.5,2.75) R1(0.75,-3.25) R24(0.75,3.25) T2(1,-2.75) T23(1,2.75) U1(1.25,-3.25) U24(1.25,3.25) V23(1.5,2.75) W1(1.75,-3.25) W24(1.75,3.25) Y2(2,-2.75) Y23(2,2.75)
C0201
  rect 0.368x0.324 smd: 1(-0.275,0) 2(0.275,0)
C0402
  rect 0.79x0.54 smd: 1(-0.545,0) 2(0.545,0)
CONN-SMD_P2.00_S2B-PH-SM4-TB-LF-SN
  rect 1x3.8 smd: 1(-1,2.925) 2(1,2.925)
  rect 1.5x3.4 smd: 3(3.35,-2.925) 4(-3.35,-2.925)
CRYSTAL-SMD_4P-L2.0-W1.6-BL
  rect 1.1x0.8 smd: 1(-0.9,-0.575) 2(0.9,-0.575) 3(0.9,0.575) 4(-0.9,0.575)
CRYSTAL-SMD_L3.2-W1.5-1
  rect 1.05x1.7 smd: 1(-1.275,0) 2(1.275,0)
HDR-SMD_2P-P2.54-H-F-L11.5
  rect 1x2 smd: 1(-1.27,0) 2(1.27,0)
HDR-SMD_6P-P2.54-H-F-L11.5
  rect 1x2 smd: 1(-6.35,0) 2(-3.81,0) 3(-1.27,0) 4(1.27,0) 5(3.81,0) 6(6.35,0)
IND-SMD_L1.0-W0.5-2
  rect 0.4x0.55 smd: 1(-0.45,0) 2(0.45,0)
KEY-SMD_B3U-1000PM
  rect 0.8x1.7 smd: 1(-1.7,0) 2(1.7,0)
L0201
  rect 0.368x0.324 smd: 1(-0.275,0) 2(0.275,0)
L0201-RD
  rect 0.368x0.324 smd: 1(-0.275,0) 2(0.275,0)
L0603
  rect 0.8x0.864 smd: 1(-0.7,0) 2(0.7,0)
MICRO-USB-SMD_10118193-0001LF
  rect 0.4x1.35 smd: 1(-1.3,1.338) 2(-0.65,1.338) 3(0,1.338) 4(0.65,1.338) 5(1.3,1.338)
  oval 1.1x1.8 hole 0.6x1.3: 6(-3.3,-1.337) 6(3.3,-1.338)
  rect 1.6x1.4 smd: 7(-3.2,1.119) 8(3.2,1.119)
  rect 1.9x1.9 smd: 7(-1.2,-1.337) 8(1.2,-1.337)
OCLGA-6_L3.5-W2.7-TL-MSM261D3526Z1CM
  rect 0.725x0.522 smd: 1(-0.838,1.038) 2(-0.838,0.215) 4(0.838,0.215) 5(0.838,1.038)
  custom 1.625x1.626 smd: 3(-0.663,-1.038)
R0201
  rect 0.303x0.324 smd: 1(-0.241,0) 2(0.241,0)
R0402
  rect 0.566x0.54 smd: 1(-0.433,0) 2(0.433,0)
SC-70-6_L2.0-W1.3-P0.65-LS2.1-BL
  rect 0.35x0.85 smd: 1(-0.65,-1.1) 2(0,-1.1) 3(0.65,-1.1) 4(0.65,1.1) 5(0,1.1) 6(-0.65,1.1)
Test-Point-0.5mm
  round 0.5 smd: 1(0,0)
WLP-6_L1.4-W0.9-R2-C3-P0.40-TL
  round 0.216 smd: A1(-0.4,0.2) A2(0,0.2) A3(0.4,0.2) B1(-0.4,-0.2) B2(0,-0.2) B3(0.4,-0.2)

## Nets
As in the schematic.

Pads without a net: AE1 2; CN2 3 4; U2 4 5; U3 4 5; U9 A8 A10 A12 A14 A16 A20 AB2 AC9 AC11 AC15 AC17 AC19 AC21 AD4 AD6 AD8 AD12 AD16 AD18 AD20 B9 B11 B13 B15 B17 B19 G1 H2 J24 K2 L24 M2 N1 P23 R24 T23 U1 U24 V23 W24 Y23; USB1 4 7 8

## Via types
v1: diameter 0.25, hole 0.15, Top Layer to Bottom Layer, 95 vias

## Routing (per net, layer and track width the routed paths; a pad name or vN(x,y) marks a point on that pad's centre or on a via; arc(x,y) is an arc through that point)
+3V3: length 15.9
  Top Layer w0.119: v1(15.19,18.28) 15.1,18.19 L1.1 ; v1(19.33,19.59) 20.27,18.65 R8.1 21.45,18.25 R7.1 23.95,15.75 v1(24.82,15.75)
  Top Layer w0.15: v1(16.67,18.44) 16.5,18.28 v1(15.19,18.28) ; U4.B2 12.79,19.14 L1.1
  Bottom Layer w0.15: v1(16.67,18.44) 16.67,19.21 17.31,19.85 19.07,19.85 v1(19.33,19.59)
AGND: length 120.7
  Top Layer w0.175: 9.69,12.8 9.26,12.37 C18.1 ; 9.69,12.8 9.69,13.65 C8.1 8.01,13.96 C13.1 6.86,13.97 C9.2 C11.2 C10.2 3.86,14.23 3.59,14.51 3.59,17.4 v1(3.84,17.66) 7.34,17.66 C2.1 C3.1 10.49,17.65 R3.1 ; 9.69,12.8 v1(9.69,11.48) ; 7.97,8.6 8.28,8.92 8.88,8.92 C24.1 ; 7.97,8.6 v1(7.97,7.41) ; 7.97,8.6 7.8,8.77 ; MIC1.2 24.26,11.8 MIC1.3 24.44,10.75 v1(24.16,10.47) 24.16,10.19 22.62,8.65 C22.1 C21.1 21.39,7.5 21.87,7.02 21.87,4.86 v1(20.98,3.96) ; 10.96,20.6 U4.A3 ; 10.96,20.6 v1(10.27,20.6) ; 10.96,20.6 v1(12.45,22.09) v1(12.45,23.58) 12.45,23.94 11.46,24.92 ; USB1.6 17.05,25.27 16.7,24.92 11.46,24.92 ; 11.46,24.92 10.45,25.94 USB1.6 ; v1(6.82,5.61) 6.82,4.45 C20.1 ; v1(15.52,7.17) 15.52,8.42 U9.0 12.52,8.42 v1(11.27,8.42) ; v1(16.41,20.6) 15.65,20.6 15.19,20.14 v1(15.19,19.37) ; TP11.1 26.8,14.14 v1(26.62,13.95) ; v1(17.56,20.6) 17.94,20.6 18.38,20.16 v1(18.38,19.24) ; C15.1 14.03,3.72 v1(14.03,4.86) 14.91,4.86 v1(15.16,5.11)
  Bottom Layer w0.175: 15.52,5.47 v1(15.16,5.11) ; 15.52,5.47 16.39,4.6 20.33,4.6 v1(20.98,3.96) ; 15.52,5.47 v1(15.52,7.17) ; v1(26.62,13.95) 26.62,11.5 25.59,10.47 v1(24.16,10.47) ; v1(12.45,23.58) 10.99,22.13 5.62,22.13 5.11,21.62 5.11,20.98 5.49,20.6 v1(6.21,20.6) ; v1(10.72,17.42) 10.82,17.53 10.82,20.05 v1(10.27,20.6) ; v1(12.45,22.09) 13.4,22.09 15.19,20.3 v1(15.19,19.37) ; CN2.1 2.35,16.16 v1(3.84,17.66) ; v1(9.69,11.48) 10.12,11.48 10.44,11.15 10.44,9.05 9.82,8.43 v1(9.37,8.43) 9.38,8.42 v1(11.27,8.42) ; v1(6.82,5.61) 7.97,6.76 v1(7.97,7.41) ; v1(16.41,20.6) v1(17.56,20.6) ; v1(19.41,14.13) 19.24,14.3 19.24,18.39 v1(18.38,19.24) ; v1(14.03,4.86) 14.03,5.08 13.55,5.56 v1(12.75,5.56)
VBUS: length 24.4
  Top Layer w0.119: 17.01,17.81 18.04,17.81 C5.1
  Top Layer w0.15: v1(7.27,20.98) 6.89,20.6 v1(6.89,19.59) ; v1(13.62,20.98) 15.05,22.41 ; 15.05,22.41 USB1.1 ; 15.05,22.41 17.05,20.41 17.05,17.84 16.77,17.57 U9.AD2
  Bottom Layer w0.15: v1(6.05,18.31) 6.38,18.64 6.38,19.08 v1(6.89,19.59) ; v1(7.27,20.98) v1(13.62,20.98)
VDD_NRF: length 58.6
  Top Layer w0.119: v1(18.83,15.4) 20.94,15.4 R19.2 ; v1(21.24,6.38) 20.1,5.24 18.66,5.24 18.28,5.62
  Top Layer w0.15: 8.01,15.05 C8.2 9.41,15.02 10.57,15.02 11.27,14.32 ; 8.01,15.05 C13.2 ; 8.01,15.05 6.87,15.05 C9.1 C11.1 C10.1 ; 11.27,14.32 11.08,14.12 11.08,13.36 U9.AD23 ; 11.27,14.32 v1(13.18,14.32) 13.77,13.72 U9.AD14 ; v1(18.57,12.35) 17.89,11.67 U9.W1 ; v1(12.6,0.92) TP9.1 17.18,0.92 18.28,2.02 18.28,5.62 17.27,6.63 U9.B1 ; v1(21.62,10.44) 22.13,9.94 v1(22.13,9.05)
  Bottom Layer w0.119: v1(21.06,15.51) 21.49,15.94 v1(21.49,17.35) ; v1(21.24,6.38) 21.49,6.63 21.49,7.02 22.13,7.65 v1(22.13,9.05) ; v1(13.18,14.32) 14.26,15.4 v1(18.83,15.4)
  Bottom Layer w0.15: v1(12.6,0.92) 11.77,1.75 v1(11.77,6.67) ; v1(21.06,15.51) 21.06,14.83 ; 21.06,14.83 v1(18.57,12.35) ; 21.06,14.83 21.06,11.01 v1(21.62,10.44)
VDDH: length 7.7
  Top Layer w0.119: v1(17.3,14.89) 17.3,15.12 19.56,17.38 20.27,17.38
  Bottom Layer w0.15: v1(16.77,11.92) 17.81,12.95 17.81,14.38 v1(17.3,14.89)
+BATT: length 10.3
  Bottom Layer w0.119: v1(2.57,18.55) 4.24,18.55 4.98,17.81 4.98,12.98 4.62,12.62 CN2.2
ANT: length 0.8
  Top Layer w0.102: L4.2 L2.1
BUTTON: length 10.2
  Top Layer w0.102: v1(21.62,9.68) 21.11,10.19 19.46,10.19 v1(18.7,10.95)
  Bottom Layer w0.102: v1(21.62,9.68) 21.87,9.43 23.4,9.43 24.41,8.41 24.41,7.33 v1(24.16,7.07) ; v1(18.7,10.95) 16.81,10.95 v1(16.77,10.92)
DCC: length 2.2
  Bottom Layer w0.102: v1(17.3,5.24) 16.52,6.02 v1(16.52,7.17)
DEC1: length 3.4
  Top Layer w0.102: C17.1 16.03,5.11 16.92,6 16.92,7.32 U9.C1
DEC46: length 14.3
  Top Layer w0.102: U9.B5 16.02,6.11 15.91,6 14.38,6 13.48,5.1 v1(13.48,4.86) 13.48,4.26 C15.2 10.06,6.08 10.06,7.46 U9.E24
  Bottom Layer w0.102: v1(13.48,4.86) 14.87,3.46 v1(15.16,3.46)
GPIO2: length 9.5
  Top Layer w0.102: v1(25.87,9.79) TP4.1
  Bottom Layer w0.102: v1(17.27,9.67) 18.05,9.67 18.42,10.04 21.77,10.04 22.02,9.79 v1(25.87,9.79)
LX: length 4
  Top Layer w0.102: 13.75,19.59 12.98,20.35 v1(11.84,20.35) ; U4.A2 11.78,19.14 v1(11.46,19.46)
  Bottom Layer w0.102: v1(11.84,20.35) 11.46,19.97 v1(11.46,19.46)
MIC_EN: length 9.1
  Top Layer w0.102: MIC1.5 22.36,13.72 R19.1 18.46,15.03 v1(17.3,13.87)
  Bottom Layer w0.102: v1(14.77,13.17) 15.48,13.87 v1(17.3,13.87)
NRF_ANT: length 2.2
  Top Layer w0.102: U9.H23 11.09,8.74 9.99,8.74 9.69,9.04 R17.2
PDM_CLK: length 14.1
  Top Layer w0.102: v1(20.48,12.09) 21.74,12.09 22.25,12.6 22.76,12.6 23.14,12.98 23.14,13.44 v1(23.18,13.48) ; TP12.1 25.18,17.43 v1(25.18,17.43)
  Bottom Layer w0.102: v1(23.18,13.48) 23.18,15.94 24.67,17.43 v1(25.18,17.43) ; v1(20.48,12.09) v1(19.33,10.95) 18.8,10.42 v1(16.77,10.42)
PDM_DATA: length 12.5
  Top Layer w0.102: TP1.1 26.93,16.39 v1(24.5,13.97) ; v1(22.36,11.8) 18.41,11.8 U9.R1
  Bottom Layer w0.102: v1(22.36,11.8) 24.5,13.95 v1(24.5,13.97)
PIEZO_READ: length 8.6
  Top Layer w0.15: v1(22.77,5.75) 24.29,5.75 TP2.1
  Bottom Layer w0.15: v1(17.27,9.17) 17.82,9.17 21.23,5.75 v1(22.77,5.75)
RESET: length 14.2
  Top Layer w0.102: v1(23.03,17.55) 23.04,17.55 TP10.1 ; v1(21.87,16.41) 19.33,16.41 v1(17.3,14.38)
  Bottom Layer w0.102: v1(14.02,12.67) 14.02,13.13 15.27,14.38 v1(17.3,14.38) ; v1(21.87,16.41) 21.89,16.41 v1(23.03,17.55)
SWDCLK: length 23.9
  Top Layer w0.102: TP7.1 19.57,21.14 v1(19.43,21.14)
  Bottom Layer w0.102: 15.24,21.02 14.4,21.86 v1(14.4,23.58) ; 15.24,21.02 19.31,21.02 v1(19.43,21.14) ; 15.24,21.02 16.29,19.97 16.29,16.92 15.65,16.29 12.6,16.29 11.21,14.89 11.21,12.6 v1(10.77,12.17)
SWDIO: length 23.2
  Top Layer w0.102: v1(18.17,23.47) 18.17,23.47 TP8.1
  Bottom Layer w0.102: v1(10.77,12.67) 10.77,15.09 12.22,16.54 15.4,16.54 15.91,17.05 15.91,19.97 13.75,22.13 v1(13.75,23.58) 13.75,23.91 14.25,24.41 16.16,24.41 U6.1
SWO: length 12.3
  Top Layer w0.102: v1(19.72,17.94) v1(18.06,16.29)
  Bottom Layer w0.102: U6.3 21.12,19.34 v1(19.72,17.94) ; v1(18.06,16.29) 17.56,15.78 13.87,15.78 11.77,13.68 v1(11.77,13.17)
XC1: length 5.7
  Top Layer w0.102: X1.3 6.82,8.34 v1(7.25,8.77)
  Bottom Layer w0.102: v1(10.77,7.17) 8.86,7.17 v1(7.25,8.77)
XC2: length 5.3
  Top Layer w0.102: 7.62,4.2 7.97,4.55 v1(7.97,5.61)
  Bottom Layer w0.102: v1(7.97,5.61) 10.21,5.61 v1(11.27,6.67)
XL1: length 5
  Top Layer w0.102: U9.D2 16.89,8.03 18.03,8.03 X2.1 20.81,6.71 C21.2
XL2: length 4.8
  Top Layer w0.102: U9.F2 16.9,8.28 18.38,8.28 X2.2 19.42,9.19 C22.2
$1N2608: length 7.2
  Top Layer w0.102: U3.1 6.21,18.94 R2.2 7.3,18.78 C2.2 7.38,18.7 8.28,18.7 9.3,19.72 9.3,20.87 9.68,21.25 U2.3
$1N2669: length 8.9
  Top Layer w0.102: v1(9.43,18.74) 12.02,18.74 U4.A1 U4.B1
  Bottom Layer w0.102: v1(9.43,18.74) 8.21,19.95 v1(8.07,19.95) v1(4.01,19.95)
$1N2785: length 4.2
  Top Layer w0.102: v1(12.86,19.46) 12.78,19.54 U4.B3
  Bottom Layer w0.102: v1(11.19,17.42) 12.6,17.42 13.11,17.94 13.11,19.21 v1(12.86,19.46)
$1N3382: length 1.8
  Top Layer w0.102: AE1.1 2.64,10.44 R4.2
$1N5000: length 0.7
  Top Layer w0.102: L2.2 R4.1
$1N15802: length 9.7
  Top Layer w0.102: v1(6.21,21.25) 5.89,21.25 5.36,20.73 5.36,20.27 C1.2 3.55,19.04 R1.2
  Bottom Layer w0.102: v1(6.21,21.25) 6.24,21.25 7.01,20.48 9.75,20.48 v1(10.27,19.95)
$1N38769: length 2.9
  Top Layer w0.102: U9.AC5 16.19,12.83 18.12,12.83 18.64,13.36
$1N38954: length 3.6
  Bottom Layer w0.102: v1(10.77,10.17) 10.82,10.22 10.82,11.33 10.36,11.8 v1(8.56,11.8)
$1N39111: length 3.5
  Top Layer w0.102: R17.1 9.82,9.95 10.06,10.19 10.06,10.57 9.7,10.93 C12.2 8.29,10.93 7.8,10.44
$1N39307: length 1.7
  Top Layer w0.102: L5.1 16.92,3.46 L6.2
$1N39479: length 1.3
  Top Layer w0.102: C23.2 12.2,5.77 12.77,6.34 12.77,6.67
$1N39540: length 1.9
  Bottom Layer w0.102: v1(9.37,7.89) 11.24,7.89 v1(11.27,7.92)

## Copper pours and planes (outline as drawn; the poured copper is in the pictures)
AGND on Top Layer: 29.56,14.26 29.53,15.02 29.45,15.78 29.34,16.53 29.19,17.28 29.01,18.03 28.78,18.76 28.53,19.48 28.23,20.18 27.91,20.87 27.55,21.55 27.15,22.2 26.73,22.84 26.27,23.45 25.79,24.04 25.28,24.61 24.74,25.15 24.17,25.66 23.58,26.15 22.96,26.6 22.33,27.03 21.67,27.42 21,27.78 20.31,28.11 19.6,28.4 18.88,28.66 18.15,28.88 17.41,29.06 16.66,29.21 15.91,29.32 15.15,29.4 14.38,29.44 13.62,29.44 12.85,29.4 12.09,29.32 11.34,29.21 10.59,29.06 9.85,28.88 9.12,28.66 8.4,28.4 7.69,28.11 7,27.78 6.33,27.42 5.67,27.03 5.04,26.6 4.42,26.15 3.83,25.66 3.26,25.15 2.72,24.61 2.21,24.04 1.73,23.45 1.27,22.84 0.85,22.2 0.45,21.55 0.09,20.87 -0.23,20.18 -0.53,19.48 -0.78,18.76 -1.01,18.03 -1.19,17.28 -1.34,16.53 -1.45,15.78 -1.53,15.02 -1.56,14.26 -1.56,13.49 -1.53,12.73 -1.45,11.97 -1.34,11.21 -1.19,10.46 -1.01,9.72 -0.78,8.99 -0.53,8.27 -0.23,7.56 0.09,6.87 0.45,6.2 0.85,5.54 1.27,4.91 1.73,4.29 2.21,3.7 2.72,3.14 3.26,2.6 3.83,2.08 4.42,1.6 5.04,1.14 5.67,0.72 6.33,0.33 7,-0.03 7.69,-0.36 8.4,-0.65 9.12,-0.91 9.85,-1.13 10.59,-1.32 11.34,-1.47 12.09,-1.58 12.85,-1.65 13.62,-1.69 14.38,-1.69 15.15,-1.65 15.91,-1.58 16.66,-1.47 17.41,-1.32 18.15,-1.13 18.88,-0.91 19.6,-0.65 20.31,-0.36 21,-0.03 21.67,0.33 22.33,0.72 22.96,1.14 23.58,1.6 24.17,2.08 24.74,2.6 25.28,3.14 25.79,3.7 26.27,4.29 26.73,4.91 27.15,5.54 27.55,6.2 27.91,6.87 28.23,7.56 28.53,8.27 28.78,8.99 29.01,9.72 29.19,10.46 29.34,11.21 29.45,11.97 29.53,12.73 29.56,13.49
AGND on Bottom Layer: 29.29,14.25 29.25,15 29.18,15.75 29.07,16.49 28.92,17.22 28.74,17.95 28.52,18.67 28.27,19.38 27.98,20.07 27.66,20.75 27.31,21.41 26.92,22.05 26.5,22.68 26.06,23.28 25.58,23.86 25.08,24.42 24.55,24.95 23.99,25.45 23.41,25.93 22.81,26.38 22.18,26.79 21.54,27.18 20.88,27.53 20.2,27.85 19.5,28.14 18.8,28.39 18.08,28.61 17.35,28.79 16.61,28.94 15.87,29.05 15.13,29.12 14.38,29.16 13.62,29.16 12.87,29.12 12.13,29.05 11.39,28.94 10.65,28.79 9.92,28.61 9.2,28.39 8.5,28.14 7.8,27.85 7.12,27.53 6.46,27.18 5.82,26.79 5.19,26.38 4.59,25.93 4.01,25.45 3.45,24.95 2.92,24.42 2.42,23.86 1.94,23.28 1.5,22.68 1.08,22.05 0.69,21.41 0.34,20.75 0.02,20.07 -0.27,19.38 -0.52,18.67 -0.74,17.95 -0.92,17.22 -1.07,16.49 -1.18,15.75 -1.25,15 -1.29,14.25 -1.29,13.5 -1.25,12.75 -1.18,12 -1.07,11.26 -0.92,10.52 -0.74,9.79 -0.52,9.08 -0.27,8.37 0.02,7.68 0.34,7 0.69,6.34 1.08,5.69 1.5,5.07 1.94,4.46 2.42,3.88 2.92,3.33 3.45,2.8 4.01,2.29 4.59,1.82 5.19,1.37 5.82,0.95 6.46,0.57 7.12,0.21 7.8,-0.11 8.5,-0.4 9.2,-0.65 9.92,-0.87 10.65,-1.05 11.39,-1.19 12.13,-1.3 12.87,-1.38 13.62,-1.42 14.38,-1.42 15.13,-1.38 15.87,-1.3 16.61,-1.19 17.35,-1.05 18.08,-0.87 18.8,-0.65 19.5,-0.4 20.2,-0.11 20.88,0.21 21.54,0.57 22.18,0.95 22.81,1.37 23.41,1.82 23.99,2.29 24.55,2.8 25.08,3.33 25.58,3.88 26.06,4.46 26.5,5.07 26.92,5.69 27.31,6.34 27.66,7 27.98,7.68 28.27,8.37 28.52,9.08 28.74,9.79 28.92,10.52 29.07,11.26 29.18,12 29.25,12.75 29.29,13.5

Small or netless copper shapes (teardrops, artwork), in the pictures only: 215 on Top Layer, 108 on Bottom Layer
